# EAGLE design lp_breadboard (EAGLE 7.2.0)
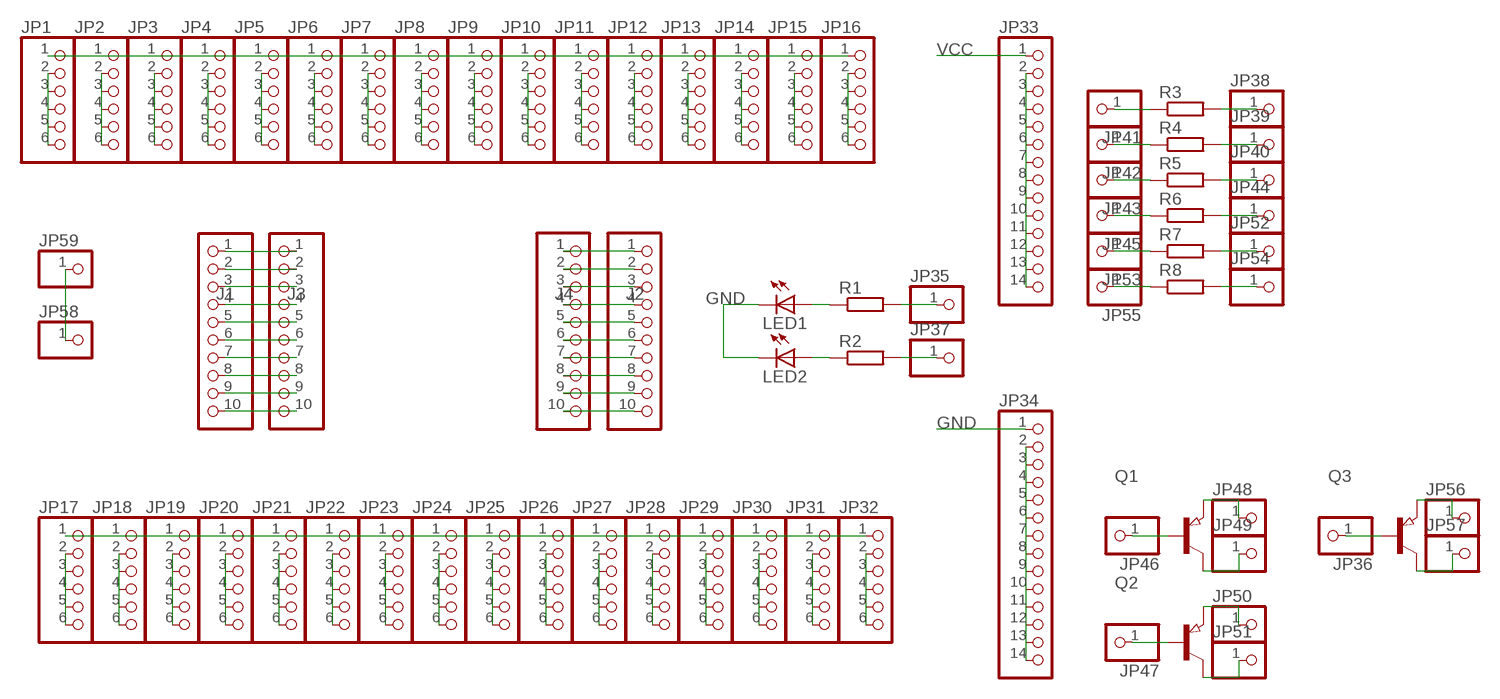
[diagram p0: schematic, sheet 1]

## Parts
J1  PINHD-1X10  [1X10]
J2  PINHD-1X10  [1X10]
J3  PINHD-1X10  [1X10]
J4  PINHD-1X10  [1X10]
JP1  PINHD-1X6  [1X06]
JP2  PINHD-1X6  [1X06]
JP3  PINHD-1X6  [1X06]
JP4  PINHD-1X6  [1X06]
JP5  PINHD-1X6  [1X06]
JP6  PINHD-1X6  [1X06]
JP7  PINHD-1X6  [1X06]
JP8  PINHD-1X6  [1X06]
JP9  PINHD-1X6  [1X06]
JP10  PINHD-1X6  [1X06]
JP11  PINHD-1X6  [1X06]
JP12  PINHD-1X6  [1X06]
JP13  PINHD-1X6  [1X06]
JP14  PINHD-1X6  [1X06]
JP15  PINHD-1X6  [1X06]
JP16  PINHD-1X6  [1X06]
JP17  PINHD-1X6  [1X06]
JP18  PINHD-1X6  [1X06]
JP19  PINHD-1X6  [1X06]
JP20  PINHD-1X6  [1X06]
JP21  PINHD-1X6  [1X06]
JP22  PINHD-1X6  [1X06]
JP23  PINHD-1X6  [1X06]
JP24  PINHD-1X6  [1X06]
JP25  PINHD-1X6  [1X06]
JP26  PINHD-1X6  [1X06]
JP27  PINHD-1X6  [1X06]
JP28  PINHD-1X6  [1X06]
JP29  PINHD-1X6  [1X06]
JP30  PINHD-1X6  [1X06]
JP31  PINHD-1X6  [1X06]
JP32  PINHD-1X6  [1X06]
JP33  PINHD-1X14  [1X14]
JP34  PINHD-1X14  [1X14]
JP35  PINHD-1X1  [1X01]
JP36  PINHD-1X1  [1X01]
JP37  PINHD-1X1  [1X01]
JP38  PINHD-1X1  [1X01]
JP39  PINHD-1X1  [1X01]
JP40  PINHD-1X1  [1X01]
JP41  PINHD-1X1  [1X01]
JP42  PINHD-1X1  [1X01]
JP43  PINHD-1X1  [1X01]
JP44  PINHD-1X1  [1X01]
JP45  PINHD-1X1  [1X01]
JP46  PINHD-1X1  [1X01]
JP47  PINHD-1X1  [1X01]
JP48  PINHD-1X1  [1X01]
JP49  PINHD-1X1  [1X01]
JP50  PINHD-1X1  [1X01]
JP51  PINHD-1X1  [1X01]
JP52  PINHD-1X1  [1X01]
JP53  PINHD-1X1  [1X01]
JP54  PINHD-1X1  [1X01]
JP55  PINHD-1X1  [1X01]
JP56  PINHD-1X1  [1X01]
JP57  PINHD-1X1  [1X01]
JP58  PINHD-1X1  [1X01]
JP59  PINHD-1X1  [1X01]
LED1  LEDCHIPLED_1206  [CHIPLED_1206]
LED2  LEDCHIPLED_1206  [CHIPLED_1206]
Q1  PNP-TRANSISTOR_SOT23  [SOT23]
Q2  PNP-TRANSISTOR_SOT23  [SOT23]
Q3  PNP-TRANSISTOR_SOT23  [SOT23]
R1  R-EU_R0805  [R0805]
R2  R-EU_R0805  [R0805]
R3  R-EU_R0805  [R0805]
R4  R-EU_R0805  [R0805]
R5  R-EU_R0805  [R0805]
R6  R-EU_R0805  [R0805]
R7  R-EU_R0805  [R0805]
R8  R-EU_R0805  [R0805]

## Nets
GND [GND]: J2.1 J4.1 JP1.1 JP2.1 JP3.1 JP4.1 JP5.1 JP6.1 JP7.1 JP8.1 JP9.1 JP10.1 JP11.1 JP12.1 JP13.1 JP14.1 JP15.1 JP16.1 JP34.1 JP58.1 JP59.1 LED1.C LED2.C
N$1: JP1.2 JP1.3 JP1.4 JP1.5 JP1.6
N$2: J1.2 J3.2
N$3: JP6.2 JP6.3 JP6.4 JP6.5 JP6.6
N$4: JP2.2 JP2.3 JP2.4 JP2.5 JP2.6
N$5: JP24.2 JP24.3 JP24.4 JP24.5 JP24.6
N$6: JP3.2 JP3.3 JP3.4 JP3.5 JP3.6
N$7: JP4.2 JP4.3 JP4.4 JP4.5 JP4.6
N$8: JP17.2 JP17.3 JP17.4 JP17.5 JP17.6
N$9: JP18.2 JP18.3 JP18.4 JP18.5 JP18.6
N$10: JP19.2 JP19.3 JP19.4 JP19.5 JP19.6
N$11: JP20.2 JP20.3 JP20.4 JP20.5 JP20.6
N$12: JP7.2 JP7.3 JP7.4 JP7.5 JP7.6
N$13: JP22.2 JP22.3 JP22.4 JP22.5 JP22.6
N$14: JP21.2 JP21.3 JP21.4 JP21.5 JP21.6
N$15: J2.2 J4.2
N$16: J2.10 J4.10
N$17: JP8.2 JP8.3 JP8.4 JP8.5 JP8.6
N$18: JP9.2 JP9.3 JP9.4 JP9.5 JP9.6
N$19: JP10.2 JP10.3 JP10.4 JP10.5 JP10.6
N$20: JP32.2 JP32.3 JP32.4 JP32.5 JP32.6
N$21: J1.10 J3.10
N$22: JP11.2 JP11.3 JP11.4 JP11.5 JP11.6
N$23: JP31.2 JP31.3 JP31.4 JP31.5 JP31.6
N$24: JP23.2 JP23.3 JP23.4 JP23.5 JP23.6
N$25: J2.3 J4.3
N$26: J2.4 J4.4
N$27: J1.3 J3.3
N$28: JP12.2 JP12.3 JP12.4 JP12.5 JP12.6
N$29: JP13.2 JP13.3 JP13.4 JP13.5 JP13.6
N$30: J1.4 J3.4
N$31: J1.5 J3.5
N$32: JP14.2 JP14.3 JP14.4 JP14.5 JP14.6
N$33: JP15.2 JP15.3 JP15.4 JP15.5 JP15.6
N$34: JP16.2 JP16.3 JP16.4 JP16.5 JP16.6
N$35: J1.6 J3.6
N$36: J2.5 J4.5
N$37: J2.6 J4.6
N$38: JP30.2 JP30.3 JP30.4 JP30.5 JP30.6
N$39: JP5.2 JP5.3 JP5.4 JP5.5 JP5.6
N$40: J1.7 J3.7
N$41: J2.7 J4.7
N$42: JP25.2 JP25.3 JP25.4 JP25.5 JP25.6
N$43: J1.8 J3.8
N$44: J1.9 J3.9
N$45: J2.8 J4.8
N$46: JP26.2 JP26.3 JP26.4 JP26.5 JP26.6
N$47: J2.9 J4.9
N$48: JP27.2 JP27.3 JP27.4 JP27.5 JP27.6
N$49: JP28.2 JP28.3 JP28.4 JP28.5 JP28.6
N$50: JP29.2 JP29.3 JP29.4 JP29.5 JP29.6
N$51: JP33.2 JP33.3 JP33.4 JP33.5 JP33.6 JP33.7 JP33.8 JP33.9 JP33.10 JP33.11 JP33.12 JP33.13 JP33.14
N$52: JP36.1 Q3.1(B)
N$53: JP34.2 JP34.3 JP34.4 JP34.5 JP34.6 JP34.7 JP34.8 JP34.9 JP34.10 JP34.11 JP34.12 JP34.13 JP34.14
N$54: LED1.A R1.1
N$55: JP56.1 Q3.2(E)
N$56: JP57.1 Q3.3(C)
N$58: JP35.1 R1.2
N$59: LED2.A R2.1
N$60: JP37.1 R2.2
N$61: JP41.1 R3.1
N$62: JP42.1 R4.1
N$63: JP43.1 R5.1
N$64: JP38.1 R3.2
N$65: JP39.1 R4.2
N$66: JP40.1 R5.2
N$67: JP45.1 R6.1
N$68: JP44.1 R6.2
N$69: JP46.1 Q1.1(B)
N$70: JP47.1 Q2.1(B)
N$71: JP48.1 Q1.2(E)
N$72: JP49.1 Q1.3(C)
N$73: JP50.1 Q2.2(E)
N$74: JP51.1 Q2.3(C)
N$75: JP53.1 R7.1
N$76: JP52.1 R7.2
N$77: JP55.1 R8.1
N$78: JP54.1 R8.2
VCC [VCC]: J1.1 J3.1 JP17.1 JP18.1 JP19.1 JP20.1 JP21.1 JP22.1 JP23.1 JP24.1 JP25.1 JP26.1 JP27.1 JP28.1 JP29.1 JP30.1 JP31.1 JP32.1 JP33.1

## Library data of the parts
J1-J4 = pinhead:PINHD-1X10: PIN HEADER
JP1-JP32 = pinhead:PINHD-1X6: PIN HEADER
JP33 JP34 = pinhead:PINHD-1X14: PIN HEADER
JP35-JP59 = pinhead:PINHD-1X1: PIN HEADER
LED1 LED2 = led:LED: LED OSRAM: - CHIPLED LG R971, LG N971, LY N971, LG Q971, LY Q971, LO R971, LY R971 LH N974, LH R974 LS Q976, LO Q976, LY Q976 LO Q996 - Hyper CHIPLED LW Q18S LB Q993, LB Q99A, LB R99A - SideLED LS A670, LO A670, LY A670, LG A670, LP A670 LB A673, LV A673, LT A673, LW A673 LH A674 LY A675 LS A676, LA A676, LO A676, LY A676, LW A676 LS A679, LY A679, LG A679 - Hyper Micro SIDELED® LS Y876, LA Y876, LO Y876, LY Y876 LT Y87S - SmartLED LW L88C, LW L88S LB L89C, LB L89S, LG L890 LS L89K, LO L89K, LY L89K LS L896, LA L896, LO L896, LY L896 - TOPLED LS T670, LO T670, LY T670, LG T670, LP T670 LSG T670, LSP T670, LSY T670, LOP T670, LYG T670 LG T671, LOG T671, LSG T671 LB T673, LV T673, LT T673, LW T673 LH T674 LS T676, LA T676, LO T676, LY T676, LB T676, LH T676, LSB T676, LW T676 LB T67C, LV T67C, LT T67C, LS T67K, LO T67K, LY T67K, LW E67C LS E67B, LA E67B, LO E67B, LY E67B, LB E67C, LV E67C, LT E67C LW T67C LS T679, LY T679, LG T679 LS T770, LO T770, LY T770, LG T770, LP T770 LB T773, LV T773, LT T773, LW T773 LH T774 LS E675, LA E675, LY E675, LS T675 LS T776, LA T776, LO T776, LY T776, LB T776 LHGB T686 LT T68C, LB T68C - Hyper Mini TOPLED® LB M676 - Mini TOPLED Santana® LG M470 LS M47K, LO M47K, LY M47K Source: http://www.osram.convergy.de LUXEON: - LUMILED® LXK2-PW12-R00, LXK2-PW12-S00, LXK2-PW14-U00, LXK2-PW14-V00 LXK2-PM12-R00, LXK2-PM12-S00, LXK2-PM14-U00 LXK2-PE12-Q00, LXK2-PE12-R00, LXK2-PE12-S00, LXK2-PE14-T00, LXK2-PE14-U00 LXK2-PB12-K00, LXK2-PB12-L00, LXK2-PB12-M00, LXK2-PB14-N00, LXK2-PB14-P00, LXK2-PB14-Q00 LXK2-PR12-L00, LXK2-PR12-M00, LXK2-PR14-Q00, LXK2-PR14-R00 LXK2-PD12-Q00, LXK2-PD12-R00, LXK2-PD12-S00 LXK2-PH12-R00, LXK2-PH12-S00 LXK2-PL12-P00, LXK2-PL12-Q00, LXK2-PL12-R00 Source: www.luxeon.com KINGBRIGHT: KA-3528ASYC Source: www.kingbright.com
Q1-Q3 = semicon-smd-ipc:PNP-TRANSISTOR_: PNP TRANSISTOR
R1-R8 = resistor:R-EU_: RESISTOR, European symbol

## Net classes
0 default: width 0.508 mm, drill 0.508 mm
1 GND: width 0.813 mm, drill 0.508 mm
2 VCC: width 0.813 mm, drill 0.508 mm

## Board
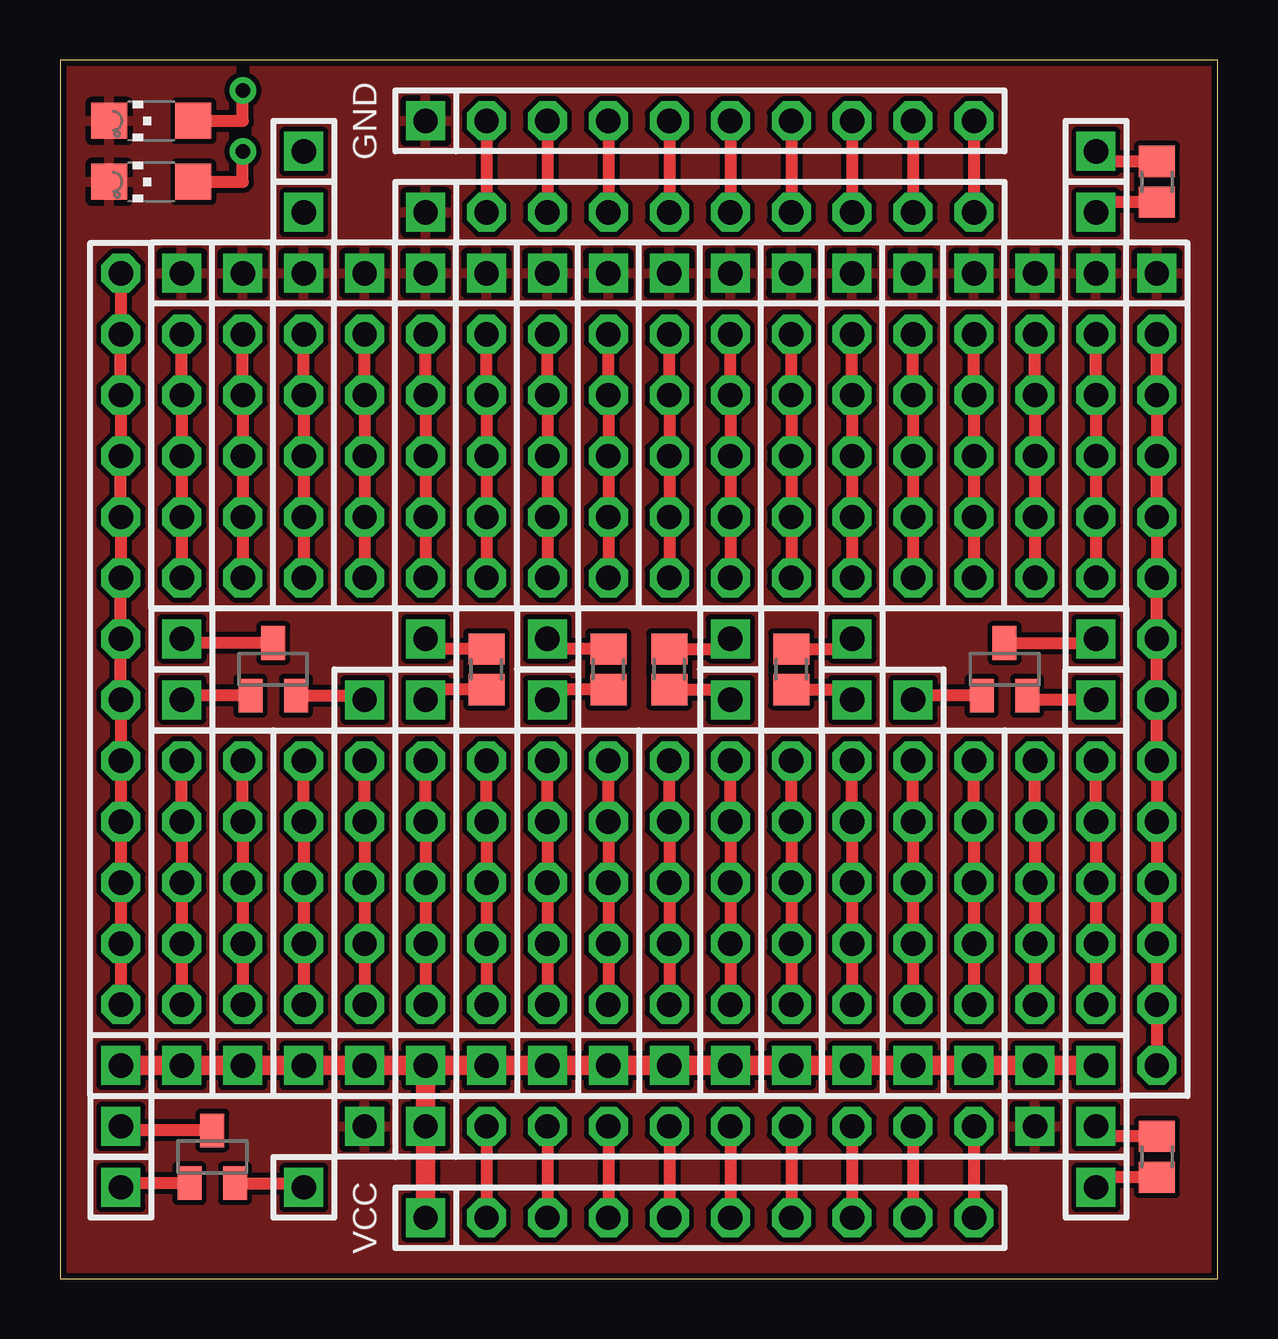
[diagram p1: board, top side]
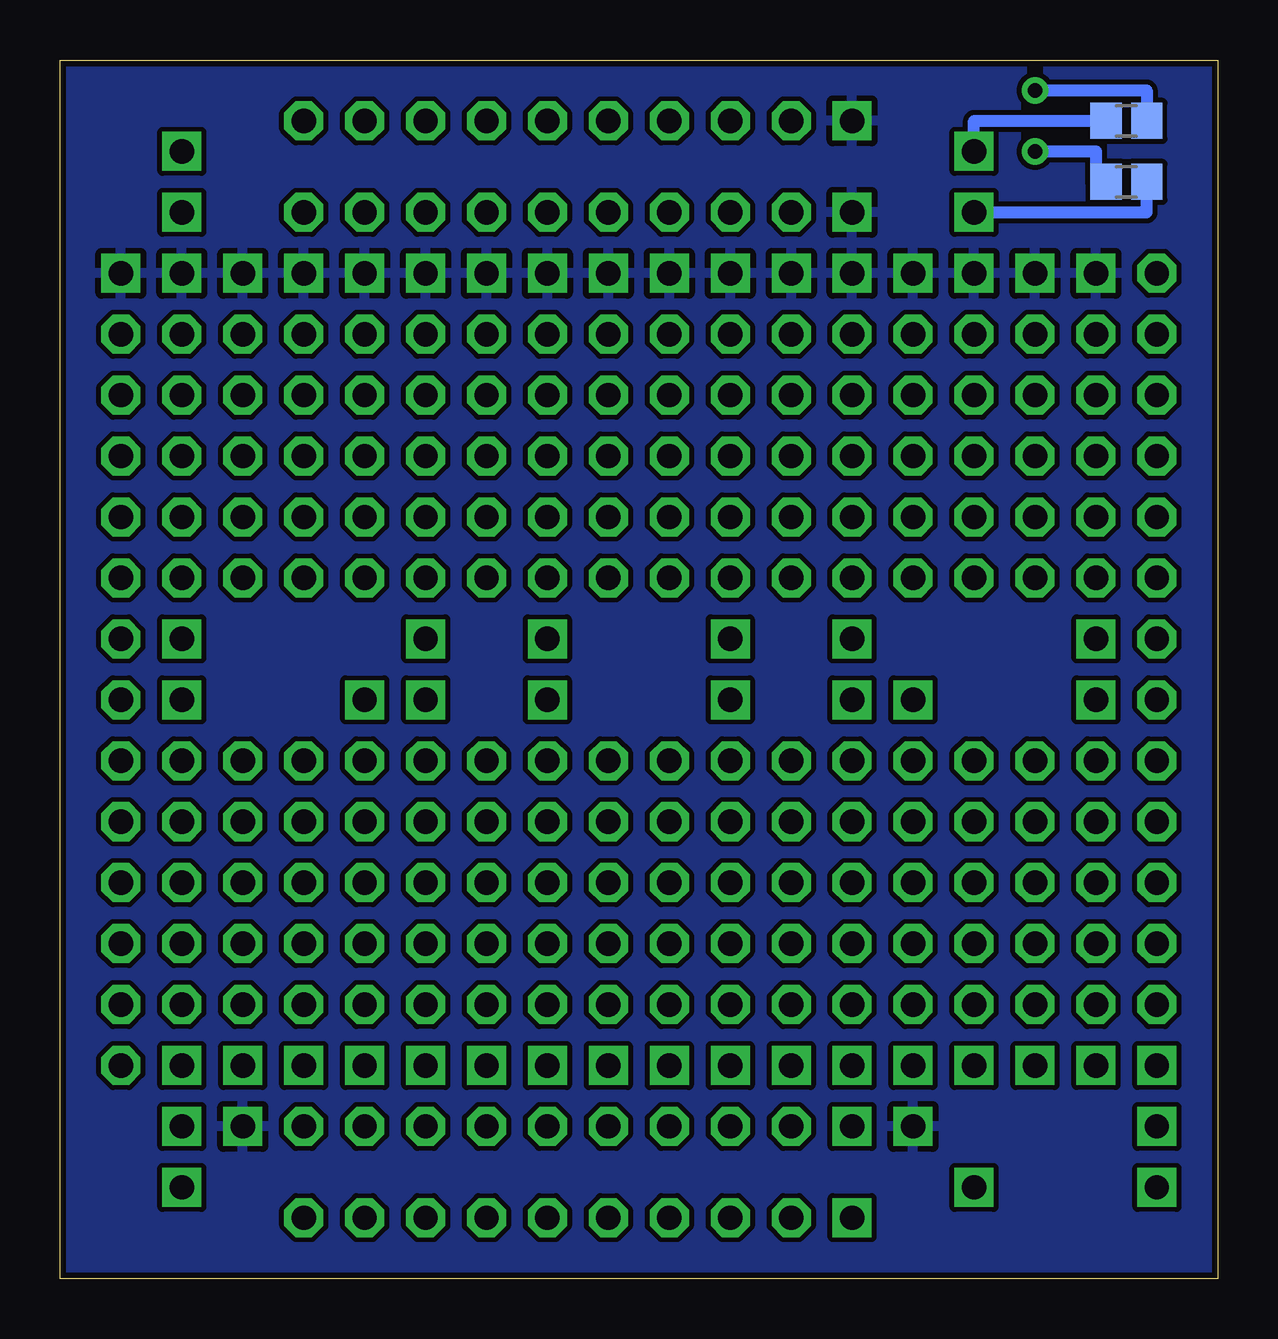
[diagram p2: board, bottom side, seen from below]

Size 48.26 x 50.8 mm. Coordinates in mm from the lower left corner, seen from the top.
Outline: 0,0 48.26,0 48.26,50.8 0,50.8 0,0
Copper layers (1*16): Top 0.035mm / dielectric 1.5mm / Bottom 0.035mm
Design rules "SparkFun *": minimum track width 20mil, minimum drill 20mil, track to track 8mil, track to pad 8mil, pad to pad 8mil, via to via 8mil, smd to smd 8mil, copper to edge 10mil, drill to drill 8mil, minimum pad ring 12mil, minimum via ring 10mil, stop-mask expansion 4mil, vias tented up to drill 25mil, thermal gap 10mil

### Footprints (pad centres in the part's own frame; a part is rotated, then mirrored left to right if it is on the bottom)
1X10 = drill 1.016 square: 1 -11.43,0 | drill 1.016 octagon: 2 -8.89,0; 3 -6.35,0; 4 -3.81,0; 5 -1.27,0; 6 1.27,0; 7 3.81,0; 8 6.35,0; 9 8.89,0; 10 11.43,0
1X06 = drill 1.016 square: 1 -6.35,0 | drill 1.016 octagon: 2 -3.81,0; 3 -1.27,0; 4 1.27,0; 5 3.81,0; 6 6.35,0
1X14 = drill 1.016 square: 1 -16.51,0 | drill 1.016 octagon: 2 -13.97,0; 3 -11.43,0; 4 -8.89,0; 5 -6.35,0; 6 -3.81,0; 7 -1.27,0; 8 1.27,0; 9 3.81,0; 10 6.35,0; 11 8.89,0; 12 11.43,0; 13 13.97,0; 14 16.51,0
1X01 = drill 1.016 square: 1 0,0
CHIPLED_1206 = smd 1.5 x 1.5: A 0,-1.75; C 0,1.75
SOT23 = smd 1 x 1.4: 1 -0.95,-1.1; 2 0.95,-1.1; 3 0,1.1
R0805 = smd 1.3 x 1.5: 1 -0.85,0; 2 0.85,0

### Placement (x,y rotation side)
J1  26.67,2.54 0 top
J2  26.67,48.26 0 top
J3  26.67,6.35 0 top
J4  26.67,44.45 0 top
JP1  5.08,35.56 270 top
JP2  7.62,35.56 270 top
JP3  10.16,35.56 270 top
JP4  12.7,35.56 270 top
JP5  15.24,35.56 270 top
JP6  17.78,35.56 270 top
JP7  20.32,35.56 270 top
JP8  22.86,35.56 270 top
JP9  25.4,35.56 270 top
JP10  27.94,35.56 270 top
JP11  30.48,35.56 270 top
JP12  33.02,35.56 270 top
JP13  35.56,35.56 270 top
JP14  38.1,35.56 270 top
JP15  40.64,35.56 270 top
JP16  43.18,35.56 270 top
JP17  43.18,15.24 90 top
JP18  40.64,15.24 90 top
JP19  38.1,15.24 90 top
JP20  35.56,15.24 90 top
JP21  33.02,15.24 90 top
JP22  30.48,15.24 90 top
JP23  27.94,15.24 90 top
JP24  25.4,15.24 90 top
JP25  22.86,15.24 90 top
JP26  20.32,15.24 90 top
JP27  17.78,15.24 90 top
JP28  15.24,15.24 90 top
JP29  12.7,15.24 90 top
JP30  10.16,15.24 90 top
JP31  7.62,15.24 90 top
JP32  5.08,15.24 90 top
JP33  2.54,25.4 90 top
JP34  45.72,25.4 270 top
JP35  10.16,46.99 0 top
JP36  2.54,3.81 0 top
JP37  10.16,44.45 0 top
JP38  43.18,3.81 0 top
JP39  43.18,44.45 0 top
JP40  15.24,26.67 0 top
JP41  43.18,6.35 0 top
JP42  43.18,46.99 0 top
JP43  15.24,24.13 0 top
JP44  33.02,24.13 0 top
JP45  33.02,26.67 0 top
JP46  5.08,24.13 0 top
JP47  35.56,24.13 0 top
JP48  12.7,24.13 0 top
JP49  5.08,26.67 0 top
JP50  43.18,24.13 90 top
JP51  43.18,26.67 0 top
JP52  20.32,26.67 0 top
JP53  20.32,24.13 0 top
JP54  27.94,26.67 0 top
JP55  27.94,24.13 0 top
JP56  10.16,3.81 0 top
JP57  2.54,6.35 0 top
JP58  12.7,6.35 0 top
JP59  40.64,6.35 0 top
LED1  3.81,48.26 90 top
LED2  3.81,45.72 90 top
Q1  8.89,25.4 0 top
Q2  39.37,25.4 0 top
Q3  6.35,5.08 0 top
R1  3.81,48.26 180 bottom
R2  3.81,45.72 0 bottom
R3  45.72,5.08 270 top
R4  45.72,45.72 270 top
R5  17.78,25.4 90 top
R6  30.48,25.4 270 top
R7  22.86,25.4 90 top
R8  25.4,25.4 90 top

### Tracks (layer width: path | path; a pad name or v marks a point on that pad's centre or on a via)
GND
  pour Bottom: 0,50.8 48.26,50.8 48.26,0 0,0
  pour Top: 0,50.8 48.26,50.8 48.26,0 0,0
N$1
  Top 0.508: JP1.6 JP1.5 JP1.4 JP1.3 JP1.2
N$2
  Top 0.508: J3.2 J1.2
N$3
  Top 0.508: JP6.6 JP6.5 JP6.4 JP6.3 JP6.2
N$4
  Top 0.508: JP2.6 JP2.5 JP2.4 JP2.3 JP2.2
N$5
  Top 0.508: JP24.2 JP24.3 JP24.4 JP24.5 JP24.6
N$6
  Top 0.508: JP3.6 JP3.5 JP3.4 JP3.3 JP3.2
N$7
  Top 0.508: JP4.6 JP4.5 JP4.4 JP4.3 JP4.2
N$8
  Top 0.508: JP17.2 JP17.3 JP17.4 JP17.5 JP17.6
N$9
  Top 0.508: JP18.2 JP18.3 JP18.4 JP18.5 JP18.6
N$10
  Top 0.508: JP19.2 JP19.3 JP19.4 JP19.5 JP19.6
N$11
  Top 0.508: JP20.2 JP20.3 JP20.4 JP20.5 JP20.6
N$12
  Top 0.508: JP7.6 JP7.5 JP7.4 JP7.3 JP7.2
N$13
  Top 0.508: JP22.2 JP22.3 JP22.4 JP22.5 JP22.6
N$14
  Top 0.508: JP21.2 JP21.3 JP21.4 JP21.5 JP21.6
N$15
  Top 0.508: J2.2 J4.2
N$16
  Top 0.508: J2.10 J4.10
N$17
  Top 0.508: JP8.6 JP8.5 JP8.4 JP8.3 JP8.2
N$18
  Top 0.508: JP9.6 JP9.5 JP9.4 JP9.3 JP9.2
N$19
  Top 0.508: JP10.6 JP10.5 JP10.4 JP10.3 JP10.2
N$20
  Top 0.508: JP32.2 JP32.3 JP32.4 JP32.5 JP32.6
N$21
  Top 0.508: J3.10 J1.10
N$22
  Top 0.508: JP11.6 JP11.5 JP11.4 JP11.3 JP11.2
N$23
  Top 0.508: JP31.2 JP31.3 JP31.4 JP31.5 JP31.6
N$24
  Top 0.508: JP23.2 JP23.3 JP23.4 JP23.5 JP23.6
N$25
  Top 0.508: J2.3 J4.3
N$26
  Top 0.508: J2.4 J4.4
N$27
  Top 0.508: J3.3 J1.3
N$28
  Top 0.508: JP12.6 JP12.5 JP12.4 JP12.3 JP12.2
N$29
  Top 0.508: JP13.6 JP13.5 JP13.4 JP13.3 JP13.2
N$30
  Top 0.508: J3.4 J1.4
N$31
  Top 0.508: J3.5 J1.5
N$32
  Top 0.508: JP14.6 JP14.5 JP14.4 JP14.3 JP14.2
N$33
  Top 0.508: JP15.6 JP15.5 JP15.4 JP15.3 JP15.2
N$34
  Top 0.508: JP16.6 JP16.5 JP16.4 JP16.3 JP16.2
N$35
  Top 0.508: J3.6 J1.6
N$36
  Top 0.508: J2.5 J4.5
N$37
  Top 0.508: J2.6 J4.6
N$38
  Top 0.508: JP30.2 JP30.3 JP30.4 JP30.5 JP30.6
N$39
  Top 0.508: JP5.6 JP5.5 JP5.4 JP5.3 JP5.2
N$40
  Top 0.508: J3.7 J1.7
N$41
  Top 0.508: J2.7 J4.7
N$42
  Top 0.508: JP25.2 JP25.3 JP25.4 JP25.5 JP25.6
N$43
  Top 0.508: J3.8 J1.8
N$44
  Top 0.508: J3.9 J1.9
N$45
  Top 0.508: J2.8 J4.8
N$46
  Top 0.508: JP26.2 JP26.3 JP26.4 JP26.5 JP26.6
N$47
  Top 0.508: J2.9 J4.9
N$48
  Top 0.508: JP27.2 JP27.3 JP27.4 JP27.5 JP27.6
N$49
  Top 0.508: JP28.2 JP28.3 JP28.4 JP28.5 JP28.6
N$50
  Top 0.508: JP29.2 JP29.3 JP29.4 JP29.5 JP29.6
N$51
  Top 0.508: JP33.2 JP33.3 JP33.4 JP33.5 JP33.6 JP33.7 JP33.8 JP33.9 JP33.10 JP33.11 JP33.12 JP33.13 JP33.14
N$52
  Top 0.508: Q3.1 2.54,3.98 JP36.1
N$53
  Top 0.508: JP34.14 JP34.13 JP34.12 JP34.11 JP34.10 JP34.9 JP34.8 JP34.7 JP34.6 JP34.5 JP34.4 JP34.3 JP34.2
N$54  (via drill 0.6)
  Top 0.508: LED1.A 7.62,48.26 v7.62,49.53
  Bottom 0.508: v7.62,49.53 2.96,49.53 R1.1
N$55
  Top 0.508: Q3.2 10.16,3.98 JP56.1
N$56
  Top 0.508: Q3.3 2.54,6.18 JP57.1
N$58
  Bottom 0.508: JP35.1 10.16,48.26 R1.2
N$59  (via drill 0.6)
  Top 0.508: LED2.A 7.62,45.72 v7.62,46.99
  Bottom 0.508: v7.62,46.99 5.08,46.99 5.08,45.72 R2.1
N$60
  Bottom 0.508: JP37.1 2.96,44.45 R2.2
N$61
  Top 0.508: R3.1 43.18,5.93 JP41.1
N$62
  Top 0.508: R4.1 43.18,46.57 JP42.1
N$63
  Top 0.508: R5.1 15.24,24.55 JP43.1
N$64
  Top 0.508: R3.2 43.18,4.23 JP38.1
N$65
  Top 0.508: R4.2 43.18,44.87 JP39.1
N$66
  Top 0.508: R5.2 15.24,26.25 JP40.1
N$67
  Top 0.508: R6.1 33.02,26.25 JP45.1
N$68
  Top 0.508: R6.2 33.02,24.55 JP44.1
N$69
  Top 0.508: Q1.1 5.08,24.3 JP46.1
N$70
  Top 0.508: Q2.1 35.56,24.3 JP47.1
N$71
  Top 0.508: Q1.2 12.7,24.3 JP48.1
N$72
  Top 0.508: Q1.3 5.08,26.5 JP49.1
N$73
  Top 0.508: JP50.1 40.32,24.13 Q2.2
N$74
  Top 0.508: Q2.3 43.18,26.5 JP51.1
N$75
  Top 0.508: R7.1 20.32,24.55 JP53.1
N$76
  Top 0.508: R7.2 20.32,26.25 JP52.1
N$77
  Top 0.508: R8.1 27.94,24.55 JP55.1
N$78
  Top 0.508: R8.2 27.94,26.25 JP54.1
VCC
  Top 0.813: J1.1 J3.1 JP28.1 | JP33.1 JP32.1 JP31.1 JP30.1 JP29.1 JP28.1 | JP28.1 JP27.1 JP26.1 JP25.1 JP24.1 JP23.1 JP22.1 JP21.1 JP20.1 JP19.1 JP18.1 JP17.1

### Text on the board
tNames: GND | VCC